# EAGLE schematic ContunityTestingRig (EAGLE 9.6.2)
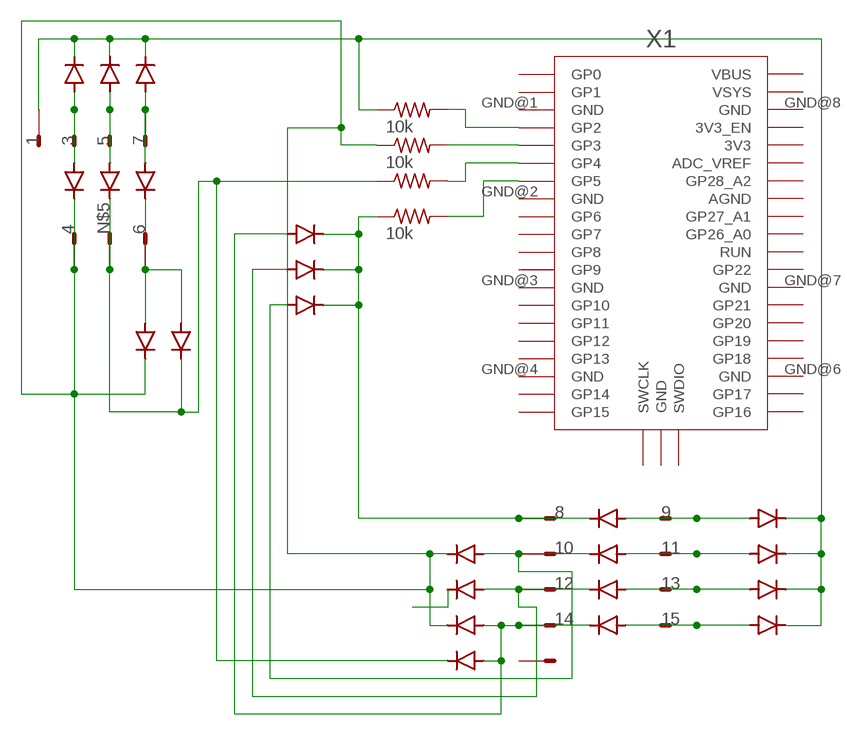
[diagram p0: schematic, sheet 1]

## Parts
D1  SCHOTTKY  DIODE_SCHOTTKY_CDBM1100-G  [MINI-SMA]
D2  SCHOTTKY  DIODE_SCHOTTKY_CDBM1100-G  [MINI-SMA]
D3  SCHOTTKY  DIODE_SCHOTTKY_CDBM1100-G  [MINI-SMA]
D4  SCHOTTKY  DIODE_SCHOTTKY_CDBM1100-G  [MINI-SMA]
D5  SCHOTTKY  DIODE_SCHOTTKY_CDBM1100-G  [MINI-SMA]
D6  SCHOTTKY  DIODE_SCHOTTKY_CDBM1100-G  [MINI-SMA]
D7  SCHOTTKY  DIODE_SCHOTTKY_CDBM1100-G  [MINI-SMA]
D8  SCHOTTKY  DIODE_SCHOTTKY_CDBM1100-G  [MINI-SMA]
D9  SCHOTTKY  DIODE_SCHOTTKY_CDBM1100-G  [MINI-SMA]
D10  SCHOTTKY  DIODE_SCHOTTKY_CDBM1100-G  [MINI-SMA]
D11  SCHOTTKY  DIODE_SCHOTTKY_CDBM1100-G  [MINI-SMA]
D12  SCHOTTKY  DIODE_SCHOTTKY_CDBM1100-G  [MINI-SMA]
D13  SCHOTTKY  DIODE_SCHOTTKY_CDBM1100-G  [MINI-SMA]
D14  SCHOTTKY  DIODE_SCHOTTKY_CDBM1100-G  [MINI-SMA]
D15  SCHOTTKY  DIODE_SCHOTTKY_CDBM1100-G  [MINI-SMA]
D16  SCHOTTKY  DIODE_SCHOTTKY_CDBM1100-G  [MINI-SMA]
D17  SCHOTTKY  DIODE_SCHOTTKY_CDBM1100-G  [MINI-SMA]
D18  SCHOTTKY  DIODE_SCHOTTKY_CDBM1100-G  [MINI-SMA]
D19  SCHOTTKY  DIODE_SCHOTTKY_CDBM1100-G  [MINI-SMA]
D20  SCHOTTKY  DIODE_SCHOTTKY_CDBM1100-G  [MINI-SMA]
D21  SCHOTTKY  DIODE_SCHOTTKY_CDBM1100-G  [MINI-SMA]
D22  SCHOTTKY  DIODE_SCHOTTKY_CDBM1100-G  [MINI-SMA]
D23  SCHOTTKY  DIODE_SCHOTTKY_CDBM1100-G  [MINI-SMA]
R1  10k  R1206FAB  [R1206FAB]
R2  10k  R1206FAB  [R1206FAB]
R3  10k  R1206FAB  [R1206FAB]
R4  10k  R1206FAB  [R1206FAB]
SV1  16E  [16P]
X1  RPI_PICO_IG-SMD  [RPI_PICO]

## Nets
1: D1.KATHODE D2.KATHODE D3.KATHODE D13.KATHODE D14.KATHODE D15.KATHODE D16.KATHODE R1.1 SV1.1
3: D1.ANODE D4.ANODE SV1.3
4: D4.KATHODE D7.KATHODE D17.KATHODE D18.KATHODE R2.1 SV1.2
5: D2.ANODE D5.ANODE SV1.5
6: D6.KATHODE D7.ANODE D8.ANODE SV1.6
7: D3.ANODE D6.ANODE SV1.7
8: D9.KATHODE D21.KATHODE D22.KATHODE D23.KATHODE R4.1 SV1.8
9: D9.ANODE D13.ANODE SV1.9
10: D10.KATHODE D17.ANODE D23.ANODE SV1.10
11: D10.ANODE D14.ANODE SV1.11
12: D11.KATHODE D19.ANODE D22.ANODE SV1.12
13: D11.ANODE D15.ANODE SV1.13
14: D12.KATHODE D18.ANODE D20.ANODE D21.ANODE SV1.14
15: D12.ANODE D16.ANODE SV1.15
N$1: R1.2 X1.GP2
N$2: R2.2 X1.GP3
N$3: R3.2 X1.GP4
N$4: R4.2 X1.GP5
N$5: D5.KATHODE D8.KATHODE D20.KATHODE R3.1 SV1.4
N$6: D19.KATHODE
Unconnected: SV1.16 X1.3V3 X1.3V3_EN X1.ADC_VREF X1.AGND X1.GND@1(GND) X1.GND@2(GND) X1.GND@3(GND) X1.GND@4(GND) X1.GND@5(GND) X1.GND@6(GND) X1.GND@7(GND) X1.GND@8(GND) X1.GP0 X1.GP1 X1.GP6 X1.GP7 X1.GP8 X1.GP9 X1.GP10 X1.GP11 X1.GP12 X1.GP13 X1.GP14 X1.GP15 X1.GP16 X1.GP17 X1.GP18 X1.GP19 X1.GP20 X1.GP21 X1.GP22 X1.GP26_A0 X1.GP27_A1 X1.GP28_A2 X1.RUN X1.SWCLK X1.SWDIO X1.VBUS X1.VSYS

## Library data of the parts
D1-D23 = eagle_fab:DIODE_SCHOTTKY_CDBM1100-G: Diode schottky 100V 1A mini-SMA as found in the fablab inventory Reverse Voltage: 100 Volts Forward Current: 1.0 Amp Maximum forward voltage: 0.85 Volts Made by Zaerc.
R1-R4 = eagle_fab:R: Resistor (US Symbol) Variants with postfix FAB are widened to allow the routing of internal traces
SV1 = con-dil:16E: DIL CABLE CONNECTOR
X1 = RaspberryPi_Pico:RPI_PICO_IG